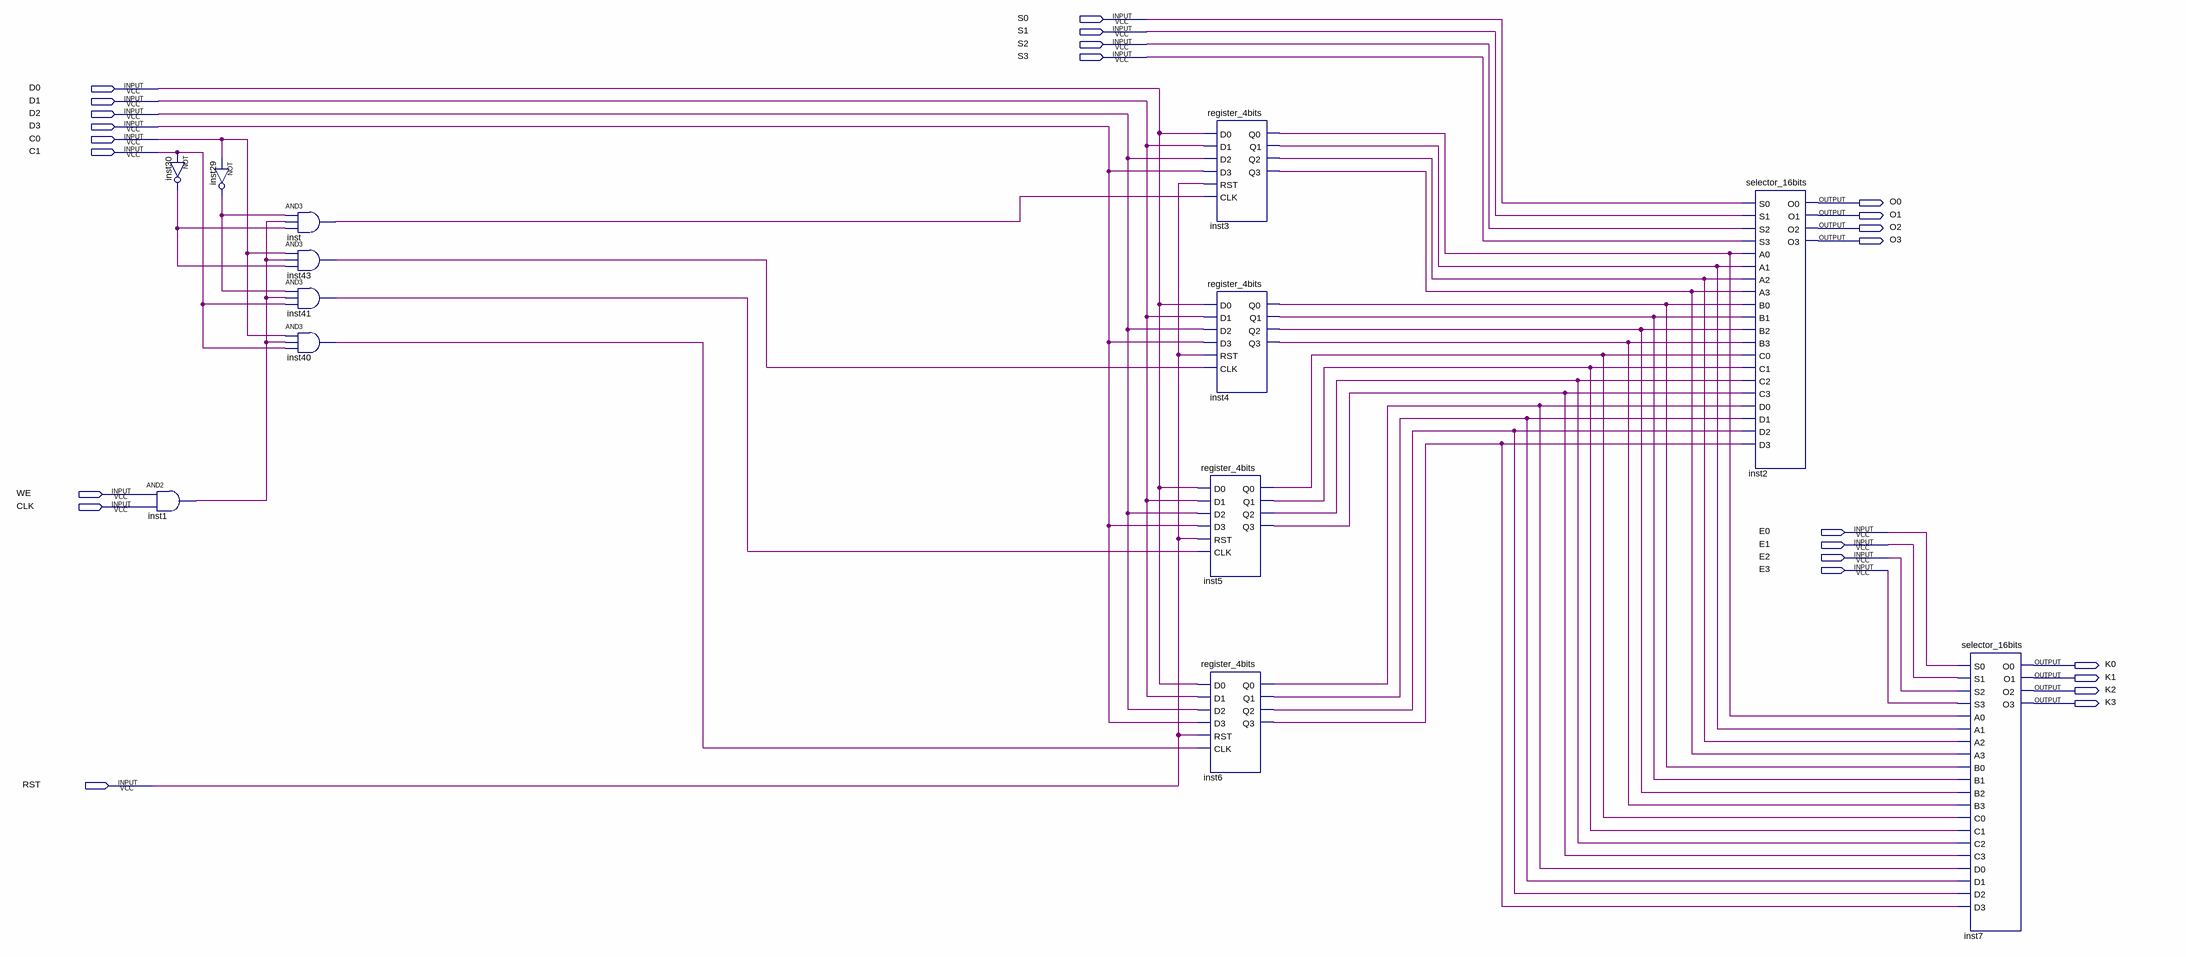
[diagram p0: schematic sheet]
// Quartus schematic register_bank_show.bdf as structural Verilog: 13 symbols, 25 pins
module register_bank_show (
  input  S0,
  input  S1,
  input  S2,
  input  S3,
  input  D0,
  input  D1,
  input  D2,
  input  D3,
  input  C0,
  input  C1,
  input  WE,
  input  CLK,
  input  E0,
  input  E1,
  input  E2,
  input  E3,
  input  RST,
  output O0,
  output O1,
  output O2,
  output O3,
  output K0,
  output K1,
  output K2,
  output K3
);

  wire inst1_out, inst3_q0, inst3_q1, inst3_q2, inst3_q3, inst4_q0, inst4_q1, inst4_q2, inst4_q3, inst5_q0,
       inst5_q1, inst5_q2, inst5_q3, inst6_q0, inst6_q1, inst6_q2, inst6_q3, inst29_out, inst30_out,
       inst40_out, inst41_out, inst43_out, inst_out;

  not inst30 (inst30_out, C1);
  and inst1 (inst1_out, WE, CLK);
  not inst29 (inst29_out, C0);
  and inst (inst_out, inst29_out, inst1_out, inst30_out);
  and inst43 (inst43_out, C0, inst1_out, inst30_out);
  and inst41 (inst41_out, inst29_out, inst1_out, C1);
  and inst40 (inst40_out, C0, inst1_out, C1);
  register_4bits inst5 (
    .D0(D0), .D1(D1), .D2(D2), .D3(D3), .RST(RST), .CLK(inst41_out), .Q0(inst5_q0), .Q1(inst5_q1),
    .Q2(inst5_q2), .Q3(inst5_q3));
  register_4bits inst6 (
    .D0(D0), .D1(D1), .D2(D2), .D3(D3), .RST(RST), .CLK(inst40_out), .Q0(inst6_q0), .Q1(inst6_q1),
    .Q2(inst6_q2), .Q3(inst6_q3));
  register_4bits inst3 (
    .D0(D0), .D1(D1), .D2(D2), .D3(D3), .RST(RST), .CLK(inst_out), .Q0(inst3_q0), .Q1(inst3_q1),
    .Q2(inst3_q2), .Q3(inst3_q3));
  register_4bits inst4 (
    .D0(D0), .D1(D1), .D2(D2), .D3(D3), .RST(RST), .CLK(inst43_out), .Q0(inst4_q0), .Q1(inst4_q1),
    .Q2(inst4_q2), .Q3(inst4_q3));
  selector_16bits inst2 (
    .S0(S0), .S1(S1), .S2(S2), .S3(S3), .A0(inst3_q0), .A1(inst3_q1), .A2(inst3_q2), .A3(inst3_q3),
    .B0(inst4_q0), .B1(inst4_q1), .B2(inst4_q2), .B3(inst4_q3), .C0(inst5_q0), .C1(inst5_q1), .C2(inst5_q2),
    .C3(inst5_q3), .D0(inst6_q0), .D1(inst6_q1), .D2(inst6_q2), .D3(inst6_q3), .O0(O0), .O1(O1), .O2(O2),
    .O3(O3));
  selector_16bits inst7 (
    .S0(E0), .S1(E1), .S2(E2), .S3(E3), .A0(inst3_q0), .A1(inst3_q1), .A2(inst3_q2), .A3(inst3_q3),
    .B0(inst4_q0), .B1(inst4_q1), .B2(inst4_q2), .B3(inst4_q3), .C0(inst5_q0), .C1(inst5_q1), .C2(inst5_q2),
    .C3(inst5_q3), .D0(inst6_q0), .D1(inst6_q1), .D2(inst6_q2), .D3(inst6_q3), .O0(K0), .O1(K1), .O2(K2),
    .O3(K3));
endmodule
